# Altium schematic sheet AjusteVoltajeRX.SchDoc
size A4
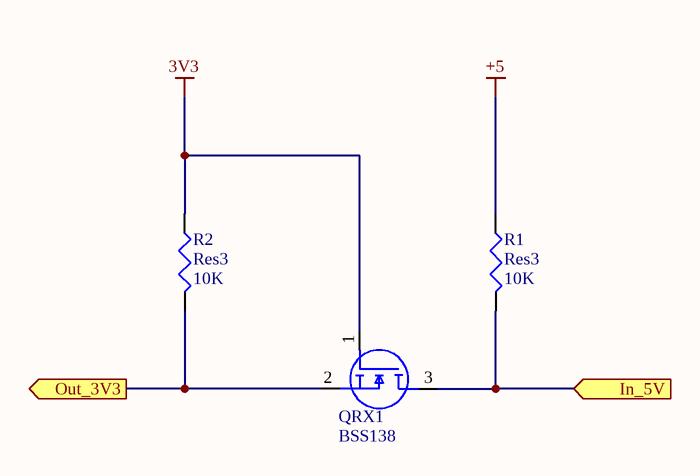
[diagram p0: AjusteVoltajeRX.SchDoc]

## Parts
QRX1  BSS138  [SOT95P240X120-3N]
R1  Res3  value 10K  [J1-0603]
R2  Res3  value 10K  [J1-0603]

## Ports
In_5V (in), Out_3V3 (out)

## Nets
3V3: QRX1.1(G) R2.1
+5: R1.1
In_5V: QRX1.3(D) R1.2 ; port In_5V
Out_3V3: QRX1.2(S) R2.2 ; port Out_3V3

## Library data of the parts
QRX1 = BSS138: MOSFET (N-Channel); Manufacturer_Name: ON Semiconductor; Datasheet Link: https://www.onsemi.com/pub/Collateral/BSS138-D.PDF; Height: 1.2mm; Manufacturer_Part_Number: BSS138; Arrow Part Number: BSS138; Arrow Price/Stock: https://www.arrow.com/en/products/bss138/on-semiconductor; Mouser Part Number: 512-BSS138; Mouser Price/Stock: https://www.mouser.co.uk/ProductDetail/ON-Semiconductor-Fairchild/BSS138?qs=HK%252BeIG1iaahCeqBvjB4arg%3D%3D
R1 R2 = Res3: Resistor; Published: 8-Jun-2000; LatestRevisionDate: 29-May-2009; LatestRevisionNote: IPC-7351 Footprint Added.; PackageReference: J1-0603; Publisher: Altium Limited; PackageDescription: Chip Resistor